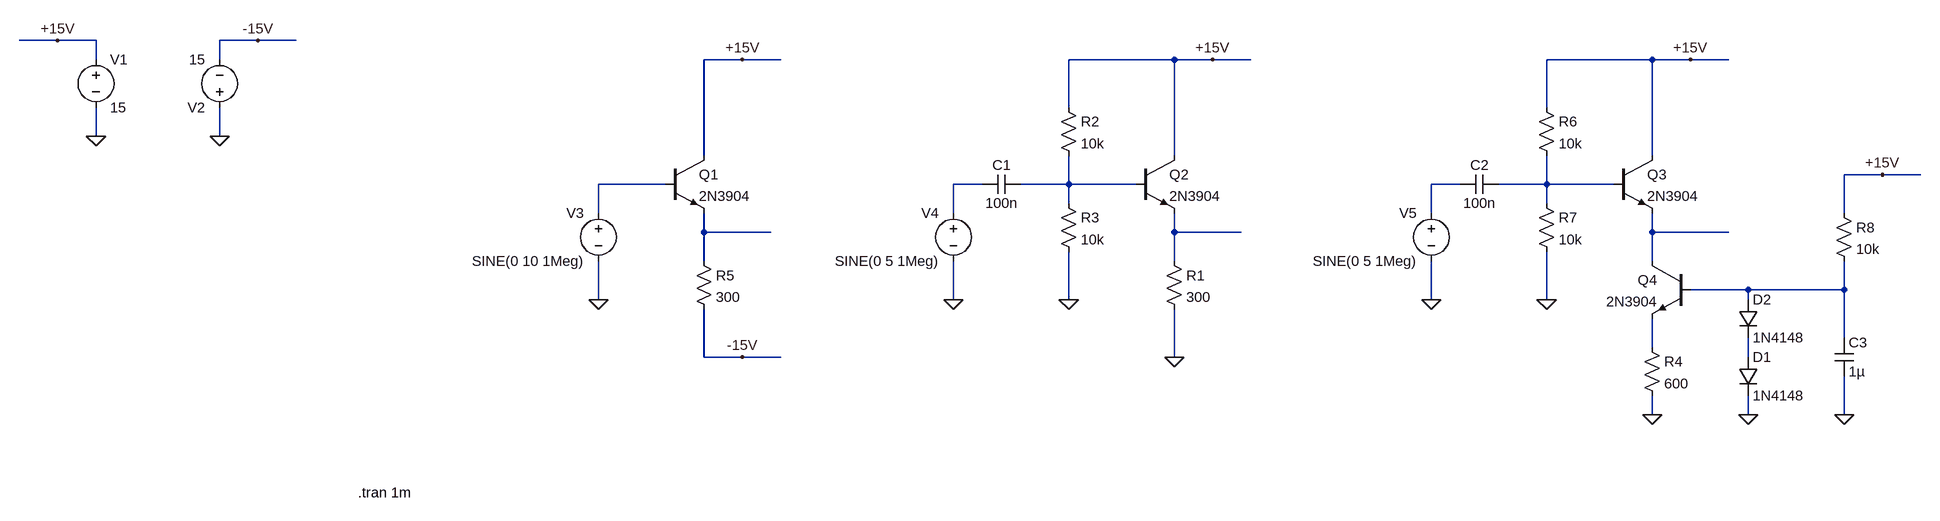
[diagram p0: schematic emitter_follower.asc]
emitter_follower.asc, the LTspice schematic file:
Version 4
SHEET 1 2404 924
WIRE -1344 -176 -1408 -176
WIRE -1280 -176 -1344 -176
WIRE -960 -176 -1024 -176
WIRE -896 -176 -960 -176
WIRE -1280 -144 -1280 -176
WIRE -1024 -144 -1024 -176
WIRE 416 -144 352 -144
WIRE 480 -144 416 -144
WIRE 1136 -144 960 -144
WIRE 1200 -144 1136 -144
WIRE 1264 -144 1200 -144
WIRE 1936 -144 1760 -144
WIRE 2000 -144 1936 -144
WIRE 2064 -144 2000 -144
WIRE 960 -64 960 -144
WIRE 1760 -64 1760 -144
WIRE -1280 -16 -1280 -64
WIRE -1024 -16 -1024 -64
WIRE 352 16 352 -144
WIRE 1136 16 1136 -144
WIRE 1936 16 1936 -144
WIRE 2320 48 2256 48
WIRE 2384 48 2320 48
WIRE 288 64 176 64
WIRE 816 64 768 64
WIRE 960 64 960 16
WIRE 960 64 880 64
WIRE 1072 64 960 64
WIRE 1616 64 1568 64
WIRE 1760 64 1760 16
WIRE 1760 64 1680 64
WIRE 1872 64 1760 64
WIRE 960 96 960 64
WIRE 1760 96 1760 64
WIRE 176 112 176 64
WIRE 768 112 768 64
WIRE 1568 112 1568 64
WIRE 2256 112 2256 48
WIRE 352 144 352 112
WIRE 464 144 352 144
WIRE 1136 144 1136 112
WIRE 1248 144 1136 144
WIRE 1936 144 1936 112
WIRE 2064 144 1936 144
WIRE 352 192 352 144
WIRE 1136 192 1136 144
WIRE 1936 192 1936 144
WIRE 2096 240 2000 240
WIRE 2256 240 2256 192
WIRE 2256 240 2096 240
WIRE 176 256 176 192
WIRE 768 256 768 192
WIRE 960 256 960 176
WIRE 1568 256 1568 192
WIRE 1760 256 1760 176
WIRE 2096 256 2096 240
WIRE 2256 320 2256 240
WIRE 1936 336 1936 288
WIRE 352 352 352 272
WIRE 416 352 352 352
WIRE 480 352 416 352
WIRE 1136 352 1136 272
WIRE 2096 352 2096 320
WIRE 1936 448 1936 416
WIRE 2096 448 2096 416
WIRE 2256 448 2256 384
FLAG 416 -144 +15V
FLAG 416 352 -15V
FLAG -1344 -176 +15V
FLAG -1280 -16 0
FLAG -1024 -16 0
FLAG -960 -176 -15V
FLAG 176 256 0
FLAG 1200 -144 +15V
FLAG 768 256 0
FLAG 1136 352 0
FLAG 960 256 0
FLAG 2000 -144 +15V
FLAG 1568 256 0
FLAG 1936 448 0
FLAG 1760 256 0
FLAG 2320 48 +15V
FLAG 2096 448 0
FLAG 2256 448 0
SYMBOL npn 288 16 R0
SYMATTR InstName Q1
SYMATTR Value 2N3904
SYMBOL voltage -1280 -160 R0
WINDOW 123 0 0 Left 0
WINDOW 39 0 0 Left 0
SYMATTR InstName V1
SYMATTR Value 15
SYMBOL voltage -1024 -48 R180
WINDOW 123 0 0 Left 0
WINDOW 39 0 0 Left 0
SYMATTR InstName V2
SYMATTR Value 15
SYMBOL voltage 176 96 M0
WINDOW 123 0 0 Left 0
WINDOW 39 0 0 Left 0
SYMATTR InstName V3
SYMATTR Value SINE(0 10 1Meg)
SYMBOL res 336 176 R0
SYMATTR InstName R5
SYMATTR Value 300
SYMBOL npn 1072 16 R0
SYMATTR InstName Q2
SYMATTR Value 2N3904
SYMBOL voltage 768 96 M0
WINDOW 123 0 0 Left 0
WINDOW 39 0 0 Left 0
SYMATTR InstName V4
SYMATTR Value SINE(0 5 1Meg)
SYMBOL res 1120 176 R0
SYMATTR InstName R1
SYMATTR Value 300
SYMBOL cap 880 48 R90
WINDOW 0 0 32 VBottom 2
WINDOW 3 32 32 VTop 2
SYMATTR InstName C1
SYMATTR Value 100n
SYMBOL res 944 -80 R0
SYMATTR InstName R2
SYMATTR Value 10k
SYMBOL res 944 80 R0
SYMATTR InstName R3
SYMATTR Value 10k
SYMBOL npn 1872 16 R0
SYMATTR InstName Q3
SYMATTR Value 2N3904
SYMBOL voltage 1568 96 M0
WINDOW 123 0 0 Left 0
WINDOW 39 0 0 Left 0
SYMATTR InstName V5
SYMATTR Value SINE(0 5 1Meg)
SYMBOL cap 1680 48 R90
WINDOW 0 0 32 VBottom 2
WINDOW 3 32 32 VTop 2
SYMATTR InstName C2
SYMATTR Value 100n
SYMBOL res 1744 -80 R0
SYMATTR InstName R6
SYMATTR Value 10k
SYMBOL res 1744 80 R0
SYMATTR InstName R7
SYMATTR Value 10k
SYMBOL npn 2000 192 M0
SYMATTR InstName Q4
SYMATTR Value 2N3904
SYMBOL res 1920 320 R0
SYMATTR InstName R4
SYMATTR Value 600
SYMBOL diode 2080 352 R0
SYMATTR InstName D1
SYMATTR Value 1N4148
SYMBOL diode 2080 256 R0
SYMATTR InstName D2
SYMATTR Value 1N4148
SYMBOL res 2240 96 R0
SYMATTR InstName R8
SYMATTR Value 10k
SYMBOL cap 2240 320 R0
SYMATTR InstName C3
SYMATTR Value 1µ
TEXT -608 736 Left 2 !.tran 1m

The netlist it stands for:
* emitter_follower.asc
Q1 +15V N001 N006 0 2N3904
V1 +15V 0 15
V2 0 -15V 15
V3 N001 0 SINE(0 10 1Meg)
R5 N006 -15V 300
Q2 +15V N003 N007 0 2N3904
V4 N002 0 SINE(0 5 1Meg)
R1 N007 0 300
C1 N003 N002 100n
R2 +15V N003 10k
R3 N003 0 10k
Q3 +15V N005 N008 0 2N3904
V5 N004 0 SINE(0 5 1Meg)
C2 N005 N004 100n
R6 +15V N005 10k
R7 N005 0 10k
Q4 N008 N009 N010 0 2N3904
R4 N010 0 600
D1 N011 0 1N4148
D2 N009 N011 1N4148
R8 +15V N009 10k
C3 N009 0 1µ
.model D D
.lib standard.dio
.model NPN NPN
.model PNP PNP
.lib standard.bjt
.tran 1m
.backanno
.end